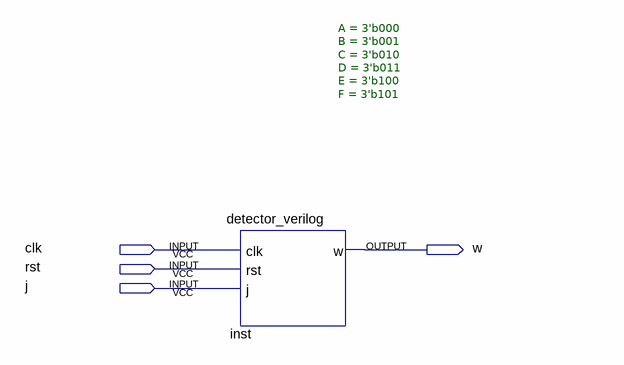
[diagram p0: schematic sheet]
// Quartus schematic Block1.bdf as structural Verilog: 1 symbols, 4 pins
module Block1 (
  input  clk,
  input  rst,
  input  j,
  output w
);

  detector_verilog #(.A(3'b000), .B(3'b001), .C(3'b010), .D(3'b011), .E(3'b100), .F(3'b101)) inst (
    .clk(clk), .rst(rst), .j(j), .w(w));
endmodule
